# Altium schematic sheet 10_Conector.SchDoc
size A4; SheetNumber: 2; SheetTotal: 12
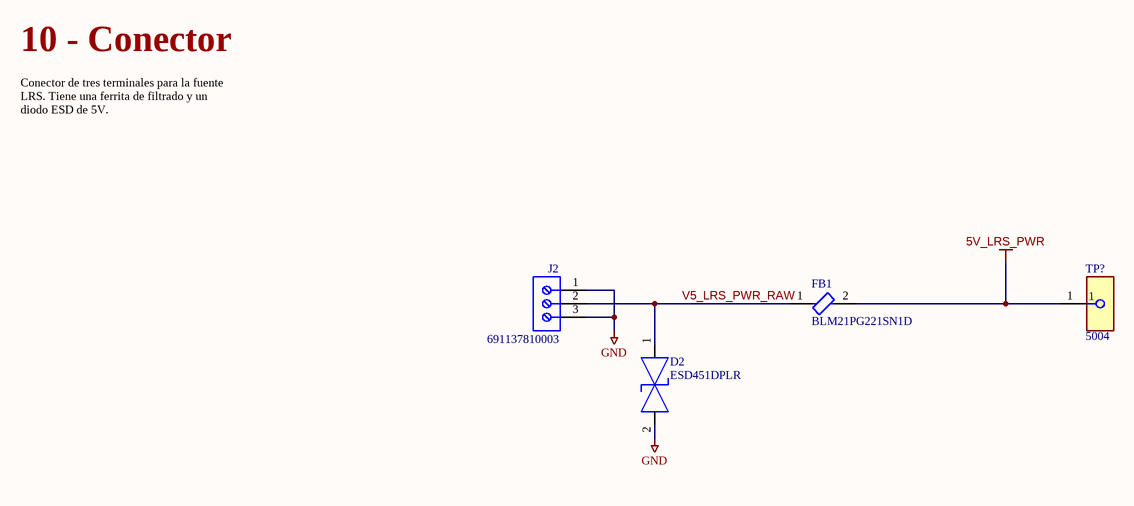
[diagram p0: 10_Conector.SchDoc]

## Parts
D2  ESD451DPLR  [FP-DPL0002A_MFG]
FB1  BLM21PG221SN1D  [FP-BLM21-0_2-t0_85-e0_5-IPC_B]
J2  691137810003  [691137810003]
TP?  5004  [FP-5004-MFG]

## Nets
5V_LRS_PWR: FB1.2 TP?.1
GND: D2.2(2_IO) J2.1 J2.3
V5_LRS_PWR_RAW: D2.1(1_IO) FB1.1 J2.2

## Notes on the sheet
- 10 - Conector
- Conector de tres terminales para la fuente LRS. Tiene una ferrita de filtrado y un diodo ESD de 5V.

## Library data of the parts
D2 = CMP-00370-140306676-1: 0.5-pF, 5.5-V, 30-KV bidirectional ESD protection device in 0201 package 2-X2SON -40 to 125; Manufacturer Lifecycle Status: ACTIVE; Thickness: 300µm; ComponentLink3URL: https://www.ti.com/lit/ds/symlink/tpd1e04u04.pdf?ts=1701165483995&ref_url=https%253A%252F%252Fwww.ti.com%252Fproduct%252FTPD1E04U04%252Fpart-details%252FTPD1E04U04DPLR; ComponentLink3Description: Manufacturer's Package Drawing; Lifecycle Status: Production; ComponentLink1URL: http://ti.com; ComponentLink2Description: HelpURL; Width: 300µm; ComponentLink2URL: https://www.ti.com/lit/ds/symlink/esd451.pdf; Height: 320µm; Number of Pins: 2; ComponentLink1Description: Manufacturer's Website; Length: 600µm
FB1 = CMP-0686-00610-3: Chip Ferrite Bead, 0805, 220Ω @ 100MHz, 0.045Ω, 25%, 2A; Number of Circuits: 1; Shielding: Unshielded; DC Resistance (DCR): 45mR; Impedance: 220R; Radiation Hardening: No; Material: Ferrite; Frequency: 100MHz; Width: 1.25mm; DC Current: 2A; Max DC Current: 2A; Number of Lines: 1; Package Quantity: 1; Case Code (Metric): 2012; Current Rating: 2A; Case/Package: 0805; Current: 2A; Military Standard: Not; Core Material: Ferrite; Depth: 1.25mm; Contact Plating: Tin; DC Resistance-Max: 45mR; Max Operating Temperature: 125°C; Length: 2mm; Max Current Rating: 2A; REACH SVHC: No SVHC; Termination: SMD/SMT; Min Operating Temperature: -55°C; Series: BLM21P; Test Frequency: 100MHz; Tolerance: 25%; Number of Pins: 2; RoHS Compliant: Yes; Height: 0.85mm; Packaging: Tape and Reel; Lead Free: Lead Free; Case Code (Imperial): 0805
J2 = CMP-1502-03382-3: 10.00 mm Terminal Block, Horizontal Entr
TP? = CMP-2000-05575-2: PC TEST POINT MINIATURE YELLOW; Manufacturer: Keystone; Number Of Contacts: 1; Is Female: yes; Device Class L1: Connectors; Manufacturer Part Number: 5004; Digikey Description: PC TEST POINT MINIATURE YELLOW; ComponentLink2URL: https://www.keyelco.com/product-pdf.cfm?p=1313; Lead Free: Yes; ComponentLink2Description: Datasheet; Category: Conn; Height: 4.72mm; Octopart: https://octopart.com/5004-keystone-28591; Mouser Description: TEST POINT PC MINI .040"D YELLOW; Device Class L3: unset; Contact Material: Silver; Package: 5004; Automotive: No; Device Class L2: unset; RoHS: TRUE